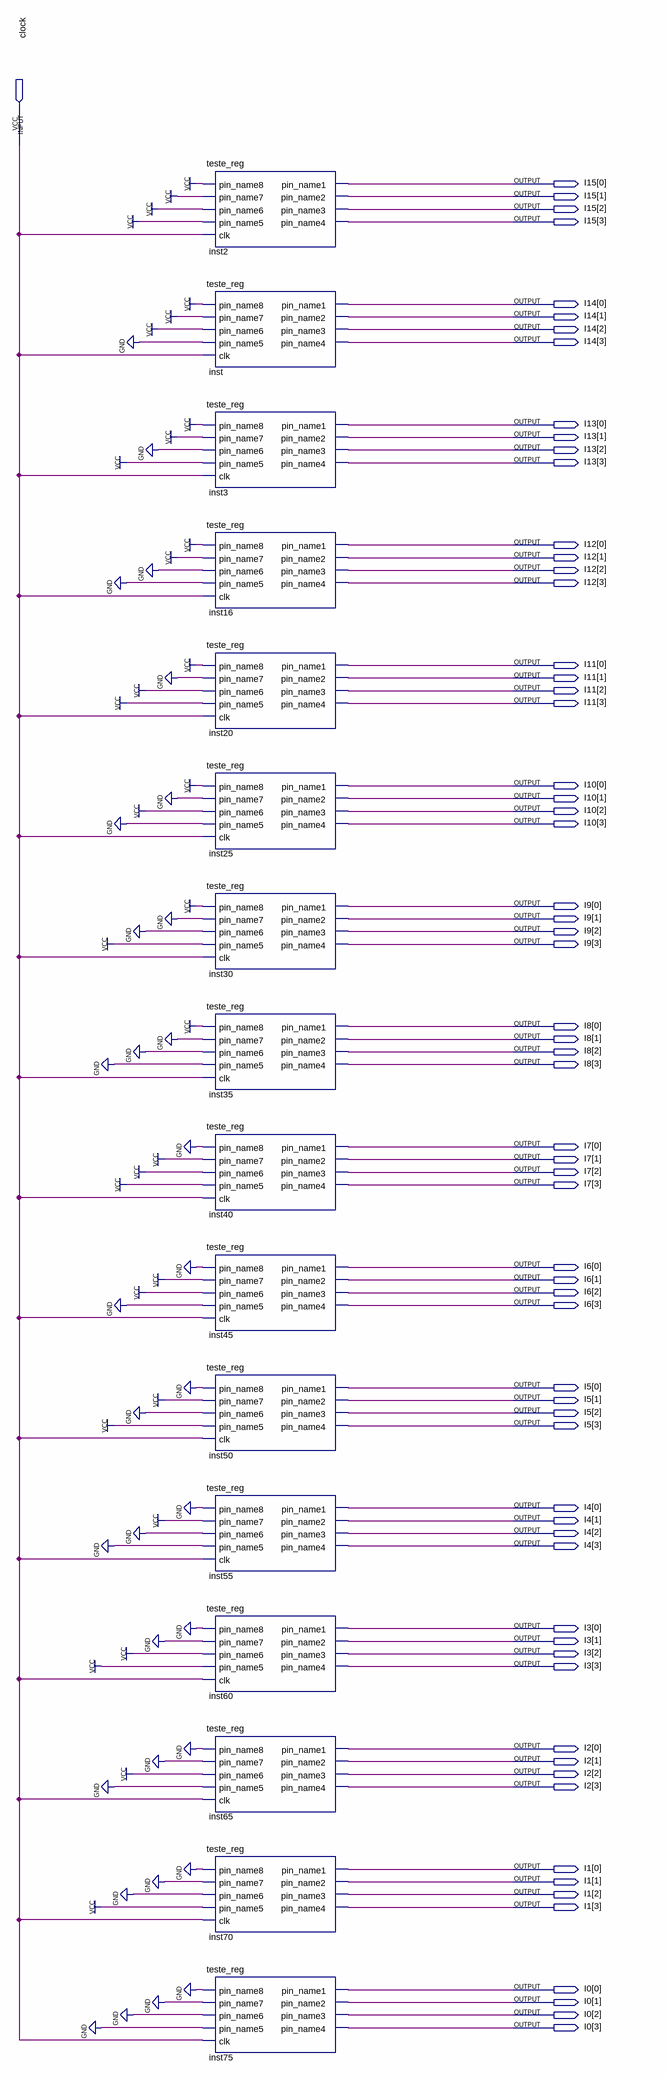
[diagram p0: schematic sheet]
// Quartus schematic Registrocompleto.bdf as structural Verilog: 16 symbols, 65 pins
module Registrocompleto (
  input  clock,
  output [3:0] I15,
  output [3:0] I14,
  output [3:0] I13,
  output [3:0] I12,
  output [3:0] I11,
  output [3:0] I10,
  output [3:0] I9,
  output [3:0] I8,
  output [3:0] I7,
  output [3:0] I6,
  output [3:0] I5,
  output [3:0] I4,
  output [3:0] I3,
  output [3:0] I2,
  output [3:0] I1,
  output [3:0] I0
);

  teste_reg inst2 (
    .pin_name8(1'b1), .pin_name7(1'b1), .pin_name6(1'b1), .pin_name5(1'b1), .clk(clock), .pin_name1(I15[0]),
    .pin_name2(I15[1]), .pin_name3(I15[2]), .pin_name4(I15[3]));
  teste_reg inst (
    .pin_name8(1'b1), .pin_name7(1'b1), .pin_name6(1'b1), .pin_name5(1'b0), .clk(clock), .pin_name1(I14[0]),
    .pin_name2(I14[1]), .pin_name3(I14[2]), .pin_name4(I14[3]));
  teste_reg inst3 (
    .pin_name8(1'b1), .pin_name7(1'b1), .pin_name6(1'b0), .pin_name5(1'b1), .clk(clock), .pin_name1(I13[0]),
    .pin_name2(I13[1]), .pin_name3(I13[2]), .pin_name4(I13[3]));
  teste_reg inst16 (
    .pin_name8(1'b1), .pin_name7(1'b1), .pin_name6(1'b0), .pin_name5(1'b0), .clk(clock), .pin_name1(I12[0]),
    .pin_name2(I12[1]), .pin_name3(I12[2]), .pin_name4(I12[3]));
  teste_reg inst20 (
    .pin_name8(1'b1), .pin_name7(1'b0), .pin_name6(1'b1), .pin_name5(1'b1), .clk(clock), .pin_name1(I11[0]),
    .pin_name2(I11[1]), .pin_name3(I11[2]), .pin_name4(I11[3]));
  teste_reg inst25 (
    .pin_name8(1'b1), .pin_name7(1'b0), .pin_name6(1'b1), .pin_name5(1'b0), .clk(clock), .pin_name1(I10[0]),
    .pin_name2(I10[1]), .pin_name3(I10[2]), .pin_name4(I10[3]));
  teste_reg inst30 (
    .pin_name8(1'b1), .pin_name7(1'b0), .pin_name6(1'b0), .pin_name5(1'b1), .clk(clock), .pin_name1(I9[0]),
    .pin_name2(I9[1]), .pin_name3(I9[2]), .pin_name4(I9[3]));
  teste_reg inst35 (
    .pin_name8(1'b1), .pin_name7(1'b0), .pin_name6(1'b0), .pin_name5(1'b0), .clk(clock), .pin_name1(I8[0]),
    .pin_name2(I8[1]), .pin_name3(I8[2]), .pin_name4(I8[3]));
  teste_reg inst40 (
    .pin_name8(1'b0), .pin_name7(1'b1), .pin_name6(1'b1), .pin_name5(1'b1), .clk(clock), .pin_name1(I7[0]),
    .pin_name2(I7[1]), .pin_name3(I7[2]), .pin_name4(I7[3]));
  teste_reg inst45 (
    .pin_name8(1'b0), .pin_name7(1'b1), .pin_name6(1'b1), .pin_name5(1'b0), .clk(clock), .pin_name1(I6[0]),
    .pin_name2(I6[1]), .pin_name3(I6[2]), .pin_name4(I6[3]));
  teste_reg inst50 (
    .pin_name8(1'b0), .pin_name7(1'b1), .pin_name6(1'b0), .pin_name5(1'b1), .clk(clock), .pin_name1(I5[0]),
    .pin_name2(I5[1]), .pin_name3(I5[2]), .pin_name4(I5[3]));
  teste_reg inst55 (
    .pin_name8(1'b0), .pin_name7(1'b1), .pin_name6(1'b0), .pin_name5(1'b0), .clk(clock), .pin_name1(I4[0]),
    .pin_name2(I4[1]), .pin_name3(I4[2]), .pin_name4(I4[3]));
  teste_reg inst60 (
    .pin_name8(1'b0), .pin_name7(1'b0), .pin_name6(1'b1), .pin_name5(1'b1), .clk(clock), .pin_name1(I3[0]),
    .pin_name2(I3[1]), .pin_name3(I3[2]), .pin_name4(I3[3]));
  teste_reg inst65 (
    .pin_name8(1'b0), .pin_name7(1'b0), .pin_name6(1'b1), .pin_name5(1'b0), .clk(clock), .pin_name1(I2[0]),
    .pin_name2(I2[1]), .pin_name3(I2[2]), .pin_name4(I2[3]));
  teste_reg inst70 (
    .pin_name8(1'b0), .pin_name7(1'b0), .pin_name6(1'b0), .pin_name5(1'b1), .clk(clock), .pin_name1(I1[0]),
    .pin_name2(I1[1]), .pin_name3(I1[2]), .pin_name4(I1[3]));
  teste_reg inst75 (
    .pin_name8(1'b0), .pin_name7(1'b0), .pin_name6(1'b0), .pin_name5(1'b0), .clk(clock), .pin_name1(I0[0]),
    .pin_name2(I0[1]), .pin_name3(I0[2]), .pin_name4(I0[3]));
endmodule
